# EAGLE design soundmotorboard (EAGLE 9.3.0)
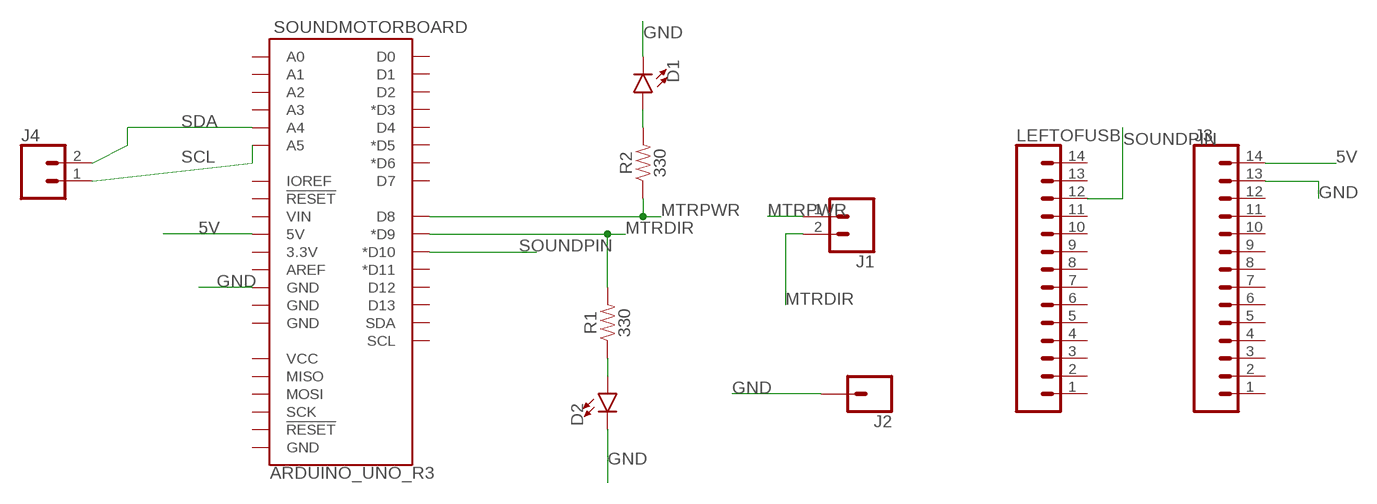
[diagram p0: schematic, sheet 1]

## Parts
D1  LED5MM  [LED_5MM]
D2  LED5MM  [LED_5MM]
J1  CONN_023.5MM-NO_SILK  [SCREWTERMINAL-3.5MM-2-NS]
J2  CONN_01  [1X01]
J3  CONN_14  [1X14]
J4  CONN_023.5MM  [SCREWTERMINAL-3.5MM-2]
LEFTOFUSB  CONN_14  [1X14]
R1  330  330OHM-HORIZ-1/10W-5%  [AXIAL-0.3]
R2  330  330OHM-HORIZ-1/10W-5%  [AXIAL-0.3]
SOUNDMOTORBOARD  ARDUINO_UNO_R3  [ARDUINO_R3]

## Nets
5V: J3.14 SOUNDMOTORBOARD.5V
GND: D1.K(C) D2.K(C) J2.1 J3.13 SOUNDMOTORBOARD.GND@4(GND)
MTRDIR: J1.2 R1.P$2 SOUNDMOTORBOARD.D9(*D9)
MTRPWR: J1.1 R2.P$1 SOUNDMOTORBOARD.D8
N$3: D1.A R2.P$2
N$4: D2.A R1.P$1
SCL: J4.1 SOUNDMOTORBOARD.A5
SDA: J4.2 SOUNDMOTORBOARD.A4
SOUNDPIN: LEFTOFUSB.12 SOUNDMOTORBOARD.D10(*D10)
Unconnected: J3.1 J3.2 J3.3 J3.4 J3.5 J3.6 J3.7 J3.8 J3.9 J3.10 J3.11 J3.12 LEFTOFUSB.1 LEFTOFUSB.2 LEFTOFUSB.3 LEFTOFUSB.4 LEFTOFUSB.5 LEFTOFUSB.6 LEFTOFUSB.7 LEFTOFUSB.8 LEFTOFUSB.9 LEFTOFUSB.10 LEFTOFUSB.11 LEFTOFUSB.13 LEFTOFUSB.14 SOUNDMOTORBOARD.3.3V SOUNDMOTORBOARD.A0 SOUNDMOTORBOARD.A1 SOUNDMOTORBOARD.A2 SOUNDMOTORBOARD.A3 SOUNDMOTORBOARD.AREF SOUNDMOTORBOARD.D0 SOUNDMOTORBOARD.D1 SOUNDMOTORBOARD.D2 SOUNDMOTORBOARD.D3(*D3) SOUNDMOTORBOARD.D4 SOUNDMOTORBOARD.D5(*D5) SOUNDMOTORBOARD.D6(*D6) SOUNDMOTORBOARD.D7 SOUNDMOTORBOARD.D11(*D11) SOUNDMOTORBOARD.D12 SOUNDMOTORBOARD.D13 SOUNDMOTORBOARD.GND@1(GND) SOUNDMOTORBOARD.GND@2(GND) SOUNDMOTORBOARD.GND@3(GND) SOUNDMOTORBOARD.IOREF SOUNDMOTORBOARD.MISO SOUNDMOTORBOARD.MOSI SOUNDMOTORBOARD.RESET@1(!RESET!) SOUNDMOTORBOARD.RESET@2(!RESET!) SOUNDMOTORBOARD.SCK SOUNDMOTORBOARD.SCL SOUNDMOTORBOARD.SDA SOUNDMOTORBOARD.VCC SOUNDMOTORBOARD.VIN

## Library data of the parts
D1 D2 = SparkFun-LED:LED: LED (Generic) Standard schematic elements and footprints for 5mm, 3mm, 1206, and 0603 sized LEDs. Generic LEDs with no color specified.
J1 J4 = SparkFun-Connectors:CONN_02: Multi connection point. Often used as Generic Header-pin footprint for 0.1 inch spaced/style header connections On any of the 0.1 inch spaced packages, you can populate with these: Break Away Headers - Straight <https://www.sparkfun.com/products/116> (PRT-00116) Break Away Male Headers - Right Angle <https://www.sparkfun.com/products/553> (PRT-00553) Female Headers <https://www.sparkfun.com/products/115> (PRT-00115) Break Away Headers - Machine Pin <https://www.sparkfun.com/products/117> (PRT-00117) Break Away Female Headers - Swiss Machine Pin <https://www.sparkfun.com/products/743> (PRT-00743) For SCREWTERMINALS and SPRING TERMINALS visit here: Screw Terimnals on SparkFun.com <https://www.sparkfun.com/search/results?term=Screw+Terminals> (5mm/3.5mm/2.54mm spacing) This device is also useful as a general connection point to wire up your design to another part of your project. Our various solder wires solder well into these plated through hole pads. Hook-Up Wire - Assortment (Stranded, 22 AWG) <https://www.sparkfun.com/products/11375> (PRT-11375) Hook-Up Wire - Assortment (Solid Core, 22 AWG) <https://www.sparkfun.com/products/11367> (PRT-11367) View the entire wire category on our website here <https://www.sparkfun.com/categories/141> Special notes: Molex polarized connector foot print use with: PRT-08233 with associated crimp pins and housings. 2.54_SCREWTERM for use with PRT-10571. 3.5mm Screw Terminal footprints for PRT-08084 5mm Screw Terminal footprints for use with PRT-08432; PROD_ID: CONN-08399
J2 = SparkFun-Connectors:CONN_01: Single connection point. Often used as Generic Header-pin footprint for 0.1 inch spaced/style header connections On any of the 0.1 inch spaced packages, you can populate with these: Break Away Headers - Straight <https://www.sparkfun.com/products/116> (PRT-00116) Break Away Male Headers - Right Angle <https://www.sparkfun.com/products/553> (PRT-00553) Female Headers <https://www.sparkfun.com/products/115> (PRT-00115) Break Away Headers - Machine Pin <https://www.sparkfun.com/products/117> (PRT-00117) Break Away Female Headers - Swiss Machine Pin <https://www.sparkfun.com/products/743> (PRT-00743) This device is also useful as a general connection point to wire up your design to another part of your project. Our various solder wires solder well into these plated through hole pads. Hook-Up Wire - Assortment (Stranded, 22 AWG) <https://www.sparkfun.com/products/11375> (PRT-11375) Hook-Up Wire - Assortment (Solid Core, 22 AWG) <https://www.sparkfun.com/products/11367> (PRT-11367) View the entire wire category on our website here <https://www.sparkfun.com/categories/141> Special notes: SMTSO-256-ET is a "flush mount" nut for a 4-40 screw. We mostly use this on specialty testbeds; it is a nice way to connect hardware to your PCB at an adjustable hieght. Also note, the SNAP packages are for using a snappable style connector. We sell a baggie of snaps and they are also used on two LilyPad designs: Snap Assortment - 30 pack (male and female) <https://www.sparkfun.com/products/11347> (DEV-11347) LilyPad Arduino SimpleSnap <https://www.sparkfun.com/products/10941> (DEV-10941) LilyPad SimpleSnap Protoboard <https://www.sparkfun.com/products/10940> (DEV-10940)
J3 LEFTOFUSB = SparkFun-Connectors:CONN_14: Multi connection point. Often used as Generic Header-pin footprint for 0.1 inch spaced/style header connections On any of the 0.1 inch spaced packages, you can populate with these: Break Away Headers - Straight <https://www.sparkfun.com/products/116> (PRT-00116) Break Away Male Headers - Right Angle <https://www.sparkfun.com/products/553> (PRT-00553) Female Headers <https://www.sparkfun.com/products/115> (PRT-00115) Break Away Headers - Machine Pin <https://www.sparkfun.com/products/117> (PRT-00117) Break Away Female Headers - Swiss Machine Pin <https://www.sparkfun.com/products/743> (PRT-00743) For SCREWTERMINALS and SPRING TERMINALS visit here: Screw Terimnals on SparkFun.com <https://www.sparkfun.com/search/results?term=Screw+Terminals> (5mm/3.5mm/2.54mm spacing) This device is also useful as a general connection point to wire up your design to another part of your project. Our various solder wires solder well into these plated through hole pads. Hook-Up Wire - Assortment (Stranded, 22 AWG) <https://www.sparkfun.com/products/11375> (PRT-11375) Hook-Up Wire - Assortment (Solid Core, 22 AWG) <https://www.sparkfun.com/products/11367> (PRT-11367) View the entire wire category on our website here <https://www.sparkfun.com/categories/141> Special notes: Molex polarized connector foot print use with SKU : PRT-08231 with associated crimp pins and housings. 1MM SMD Version SKU: PRT-10208 NOTES ON THE VARIANTS LOCK and LOCK_LONGPADS... This footprint was designed to help hold the alignment of a through-hole component (i.e. 6-pin header) while soldering it into place. You may notice that each hole has been shifted either up or down by 0.005 of an inch from it's more standard position (which is a perfectly straight line). This slight alteration caused the pins (the squares in the middle) to touch the edges of the holes. Because they are alternating, it causes a "brace" to hold the component in place. 0.005 has proven to be the perfect amount of "off-center" position when using our standard breakaway headers. Although looks a little odd when you look at the bare footprint, once you have a header in there, the alteration is very hard to notice. Also,if you push a header all the way into place, it is covered up entirely on the bottom side.
R1 R2 = SparkFun-Resistors:330OHM: 330Ω resistor A resistor is a passive two-terminal electrical component that implements electrical resistance as a circuit element. Resistors act to reduce current flow, and, at the same time, act to lower voltage levels within circuits. - Wikipedia; PROD_ID: RES-8371
SOUNDMOTORBOARD = SparkFun-Boards:ARDUINO_UNO_R3: Arduino R3 Footprint with SPI header Arduino Uno R3 Compatible Footprint. Matches PCB size of the original board. SparkFun Products: SAMD21 Dev Breakout <https://www.sparkfun.com/products/13672> RedBoard <https://www.sparkfun.com/products/12757> R3 Stackable Headers <https://www.sparkfun.com/products/11417>

## Board
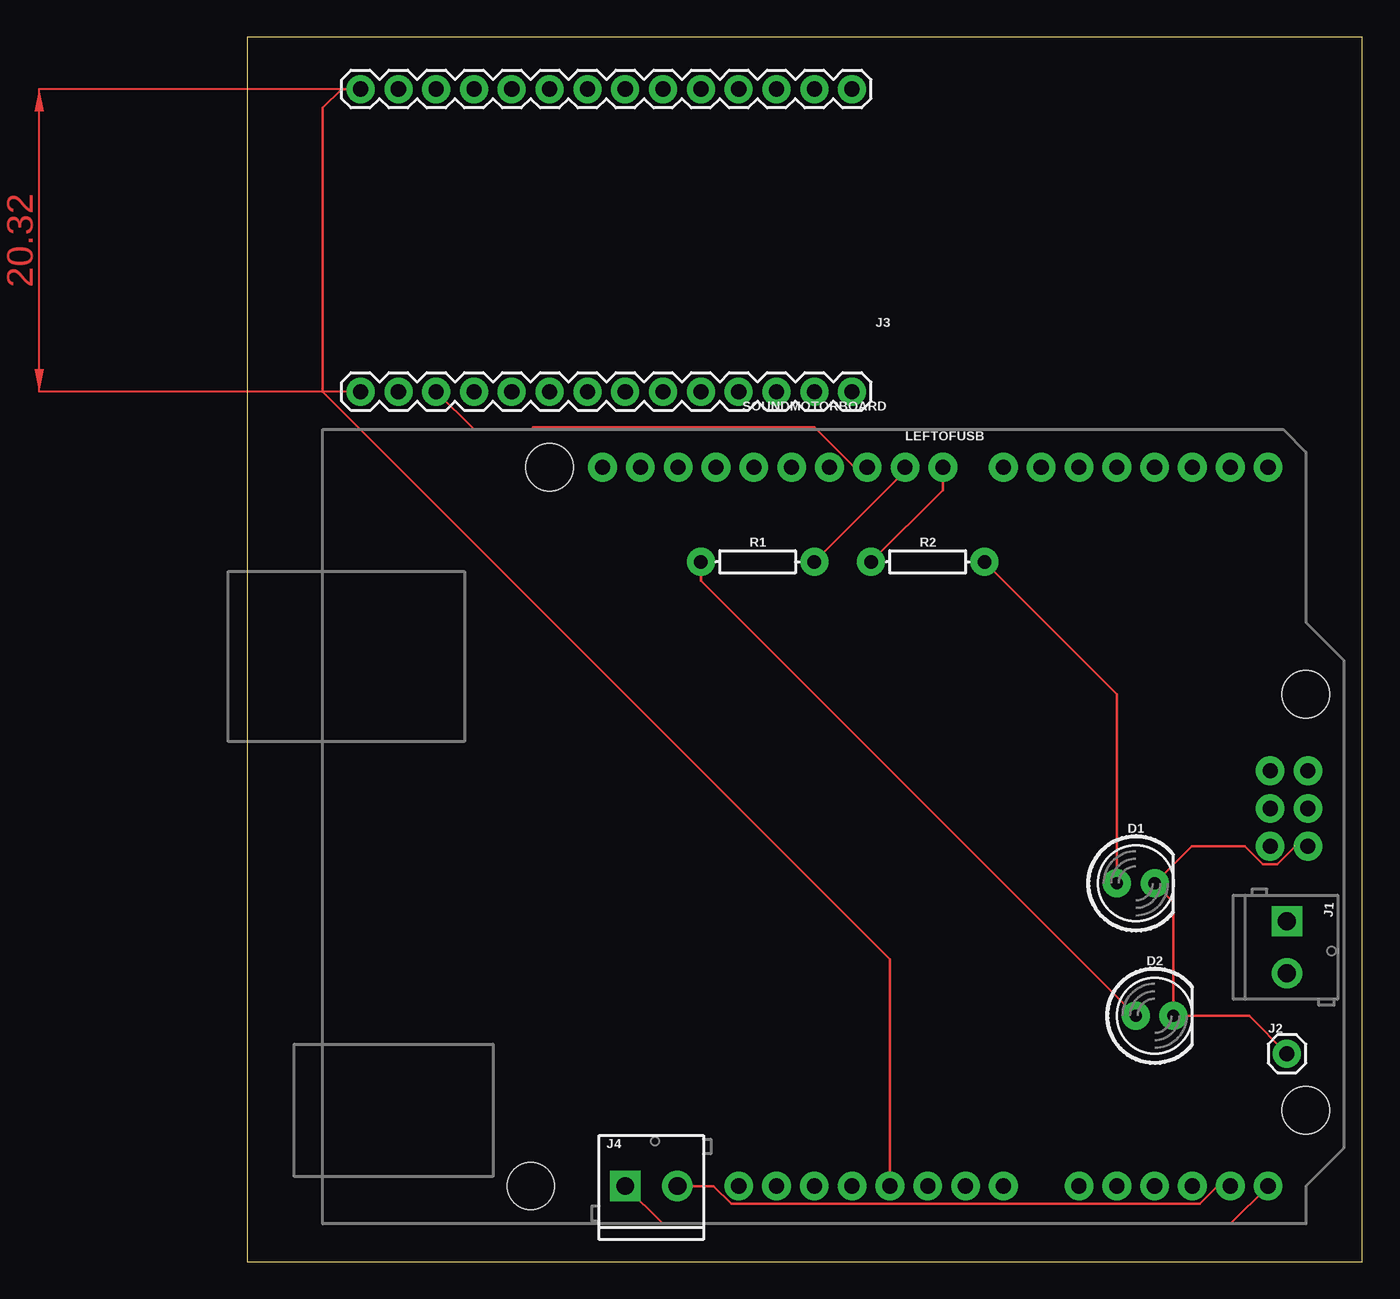
[diagram p1: board, top side]
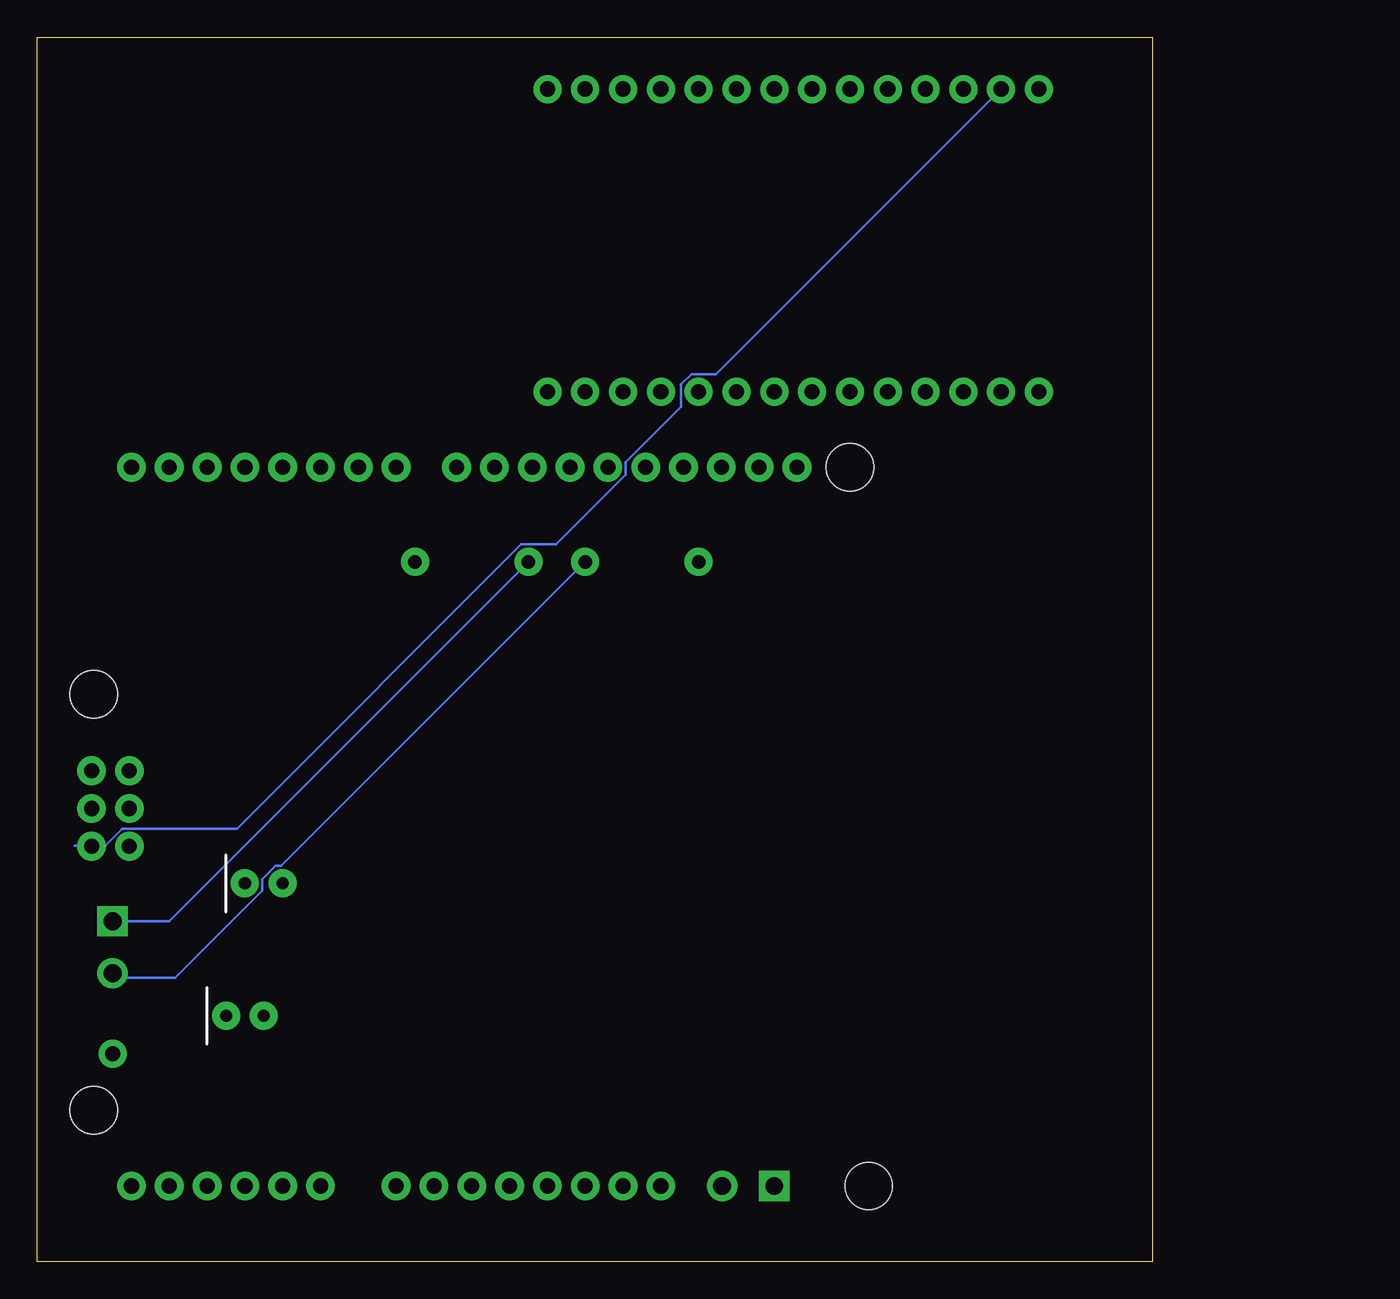
[diagram p2: board, bottom side, seen from below]

Size 74.91 x 82.22 mm. Coordinates in mm from the lower left corner, seen from the top.
Outline: 0,0 74.91,0 74.91,82.22 0,82.22 0,0
Copper layers (1*16): Top 0.035mm / dielectric 1.5mm / Bottom 0.035mm
Design rules "default": minimum track width 6mil, minimum drill 0.35mm, track to track 6mil, track to pad 6mil, pad to pad 6mil, via to via 6mil, smd to smd 6mil, copper to edge 40mil, drill to drill 6mil, minimum pad ring 10mil, minimum via ring 8mil, stop-mask expansion 4mil, vias tented up to drill 0mil, thermal gap 10mil

### Footprints (pad centres in the part's own frame; a part is rotated, then mirrored left to right if it is on the bottom)
LED_5MM = drill 0.813 pad 1.88: A -1.27,0; K 1.27,0
SCREWTERMINAL-3.5MM-2-NS = drill 1.2 pad 2.032 square: 1 0,0 | drill 1.2 pad 2.032: 2 3.5,0
1X01 = drill 1.016 pad 1.88: 1 0,0
1X14 = drill 1.016 pad 1.88: 1 0,0; 2 2.54,0; 3 5.08,0; 4 7.62,0; 5 10.16,0; 6 12.7,0; 7 15.24,0; 8 17.78,0; 9 20.32,0; 10 22.86,0; 11 25.4,0; 12 27.94,0; 13 30.48,0; 14 33.02,0
SCREWTERMINAL-3.5MM-2 = drill 1.2 pad 2.032 square: 1 0,0 | drill 1.2 pad 2.032: 2 3.5,0
AXIAL-0.3 = drill 0.9 pad 1.88: P$1 -3.81,0; P$2 3.81,0
ARDUINO_R3 = drill 1.016 pad 1.93: 3.3V 2.54,-24.13; 5V 5.08,-24.13; A0 17.78,-24.13; A1 20.32,-24.13; A2 22.86,-24.13; A3 25.4,-24.13; A4 27.94,-24.13; A5 30.48,-24.13; AREF -9.144,24.13; D0 30.48,24.13; D1 27.94,24.13; D2 25.4,24.13; D3 22.86,24.13; D4 20.32,24.13; D5 17.78,24.13; D6 15.24,24.13; D7 12.7,24.13; D8 8.636,24.13; D9 6.096,24.13; D10 3.556,24.13; D11 1.016,24.13; D12 -1.524,24.13; D13 -4.064,24.13; GND@1 7.62,-24.13; GND@2 10.16,-24.13; GND@3 -6.604,24.13; GND@4 33.16,-1.32; IOREF -2.54,-24.13; MISO 30.62,3.76; MOSI 33.16,1.22; NC -5.08,-24.13; RESET@1 0,-24.13; RESET@2 30.62,-1.32; SCK 30.62,1.22; SCL -14.224,24.13; SDA -11.684,24.13; VCC 33.16,3.76; VIN 12.7,-24.13 | hole 3.175: -17.78,24.13; 33.02,8.89; 33.02,-19.05; -19.05,-24.13

### Placement (x,y rotation side)
D1  59.69,25.4 0 top
D2  60.96,16.51 0 top
J1  69.85,22.86 270 top
J2  69.85,13.97 0 top
J3  40.64,78.74 180 top
J4  25.4,5.08 0 top
LEFTOFUSB  40.64,58.42 180 top
R1  34.29,46.99 0 top
R2  45.72,46.99 0 top
SOUNDMOTORBOARD  38.1,29.21 0 top

### Tracks (layer width: path | path; a pad name or v marks a point on that pad's centre or on a via)
5V
  Top 0.152: SOUNDMOTORBOARD.5V 43.18,20.32 5.08,58.42 5.08,77.47 6.35,78.74 J3.14
GND  (1 unrouted)
  Top 0.152: J2.1 67.31,16.51 D2.K 62.23,24.13 D1.K 63.45,27.89 67.03,27.89 68.23,26.7 69.22,26.7 70.41,27.89 SOUNDMOTORBOARD.GND@4
  Bottom 0.152: J3.13 29.31,59.59 30.96,59.59 31.65,58.9 31.65,57.42 35.38,53.68 35.38,52.85 40.07,48.16 42.39,48.16 61.47,29.08 69.22,29.08 70.36,27.94 72.39,27.94
MTRDIR
  Top 0.152: R1.P$2 44.2,53.09 SOUNDMOTORBOARD.D9
  Bottom 0.152: R1.P$2 58.52,26.57 58.9,26.57 59.79,25.68 59.79,24.92 65.66,19.05 69.85,19.05 J1.2
MTRPWR
  Top 0.152: R2.P$1 46.74,51.82 SOUNDMOTORBOARD.D8
  Bottom 0.152: J1.1 66.04,22.86 R2.P$1
N$3
  Top 0.152: R2.P$2 58.42,38.1 D1.A
N$4
  Top 0.152: D2.A 30.48,45.72 R1.P$1
SCL
  Top 0.152: SOUNDMOTORBOARD.A5 66.04,2.54 27.94,2.54 J4.1
SDA
  Top 0.152: SOUNDMOTORBOARD.A4 65.19,5.08 63.99,3.89 32.53,3.89 31.33,5.08 J4.2
SOUNDPIN
  Top 0.152: LEFTOFUSB.12 15.24,55.88 19.07,55.88 19.21,56.02 38.12,56.02 40.8,53.34 SOUNDMOTORBOARD.D10
(copper drawn outside any net)
  shapes: Top area x1